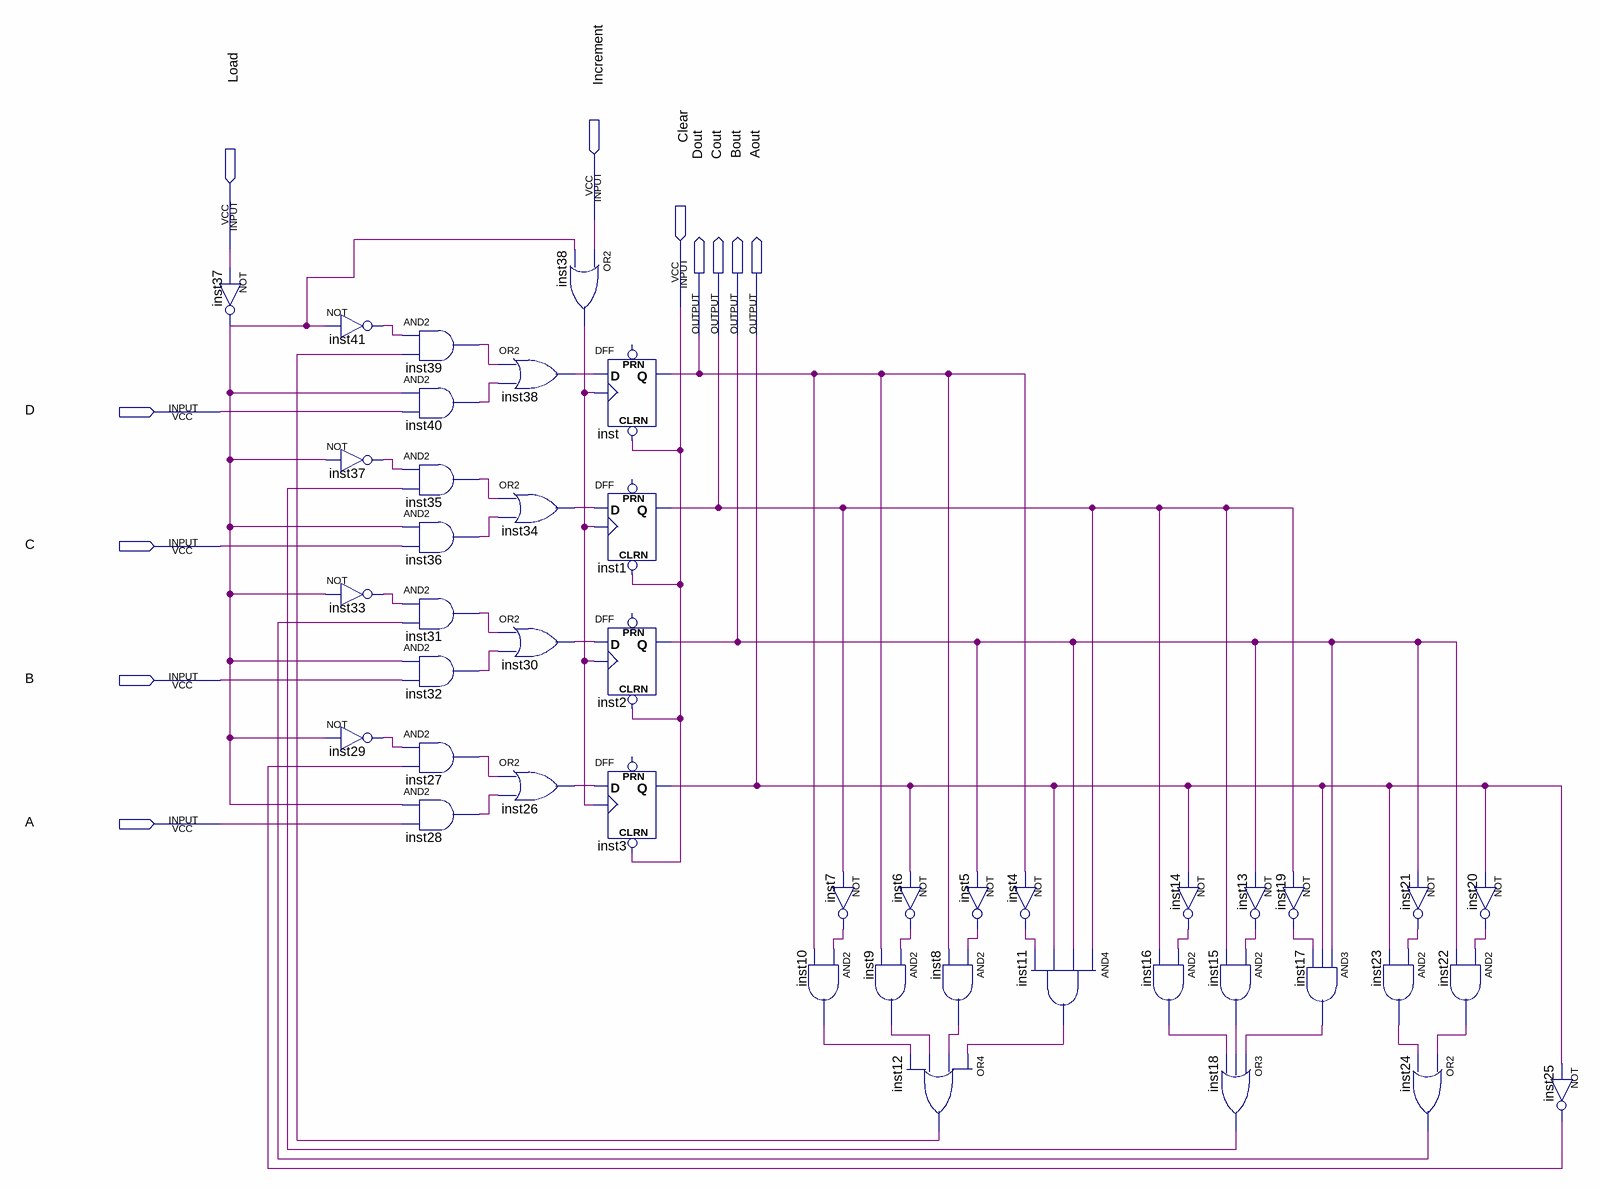
[diagram p0: schematic sheet]
// Quartus schematic Lab6_4.bdf as structural Verilog: 44 symbols, 11 pins
module Lab6_4 (
  input  Increment,
  input  Load,
  input  Clear,
  input  D,
  input  C,
  input  B,
  input  A,
  output Dout,
  output Cout,
  output Bout,
  output Aout
);

  wire inst4_out, inst5_out, inst6_out, inst7_out, inst8_out, inst9_out, inst10_out, inst11_out, inst12_out,
       inst13_out, inst14_out, inst15_out, inst16_out, inst17_out, inst18_out, inst19_out, inst20_out,
       inst21_out, inst22_out, inst23_out, inst24_out, inst25_out, inst26_out, inst27_out, inst28_out,
       inst29_out, inst30_out, inst31_out, inst32_out, inst33_out, inst34_out, inst35_out, inst36_out,
       inst37_out, inst37_out_2, inst38_out, inst38_out_2, inst39_out, inst40_out, inst41_out;

  not inst37 (inst37_out_2, Load);
  not inst41 (inst41_out, inst37_out_2);
  not inst37_dup2 (inst37_out, inst37_out_2);
  not inst33 (inst33_out, inst37_out_2);
  not inst29 (inst29_out, inst37_out_2);
  and inst39 (inst39_out, inst41_out, inst12_out);
  and inst40 (inst40_out, inst37_out_2, D);
  and inst35 (inst35_out, inst37_out, inst18_out);
  and inst36 (inst36_out, inst37_out_2, C);
  and inst31 (inst31_out, inst33_out, inst24_out);
  and inst32 (inst32_out, inst37_out_2, B);
  and inst27 (inst27_out, inst29_out, inst25_out);
  and inst28 (inst28_out, inst37_out_2, A);
  or inst38 (inst38_out, inst39_out, inst40_out);
  or inst34 (inst34_out, inst35_out, inst36_out);
  or inst30 (inst30_out, inst31_out, inst32_out);
  or inst26 (inst26_out, inst27_out, inst28_out);
  or inst38_dup2 (inst38_out_2, Increment, inst37_out_2);
  DFF inst (.CLRN(Clear), .CLK(inst38_out_2), .D(inst38_out), .Q(Dout));  // open: PRN
  DFF inst1 (.CLRN(Clear), .CLK(inst38_out_2), .D(inst34_out), .Q(Cout));  // open: PRN
  DFF inst2 (.CLRN(Clear), .CLK(inst38_out_2), .D(inst30_out), .Q(Bout));  // open: PRN
  DFF inst3 (.CLRN(Clear), .CLK(inst38_out_2), .D(inst26_out), .Q(Aout));  // open: PRN
  not inst7 (inst7_out, Cout);
  and inst10 (inst10_out, inst7_out, Dout);
  not inst6 (inst6_out, Aout);
  and inst9 (inst9_out, inst6_out, Dout);
  or inst12 (inst12_out, inst11_out, inst8_out, inst9_out, inst10_out);
  not inst5 (inst5_out, Bout);
  and inst8 (inst8_out, inst5_out, Dout);
  not inst4 (inst4_out, Dout);
  and inst11 (inst11_out, Cout, Bout, Aout, inst4_out);
  and inst16 (inst16_out, inst14_out, Cout);
  not inst14 (inst14_out, Aout);
  and inst15 (inst15_out, inst13_out, Cout);
  or inst18 (inst18_out, inst17_out, inst15_out, inst16_out);
  not inst13 (inst13_out, Bout);
  not inst19 (inst19_out, Cout);
  and inst17 (inst17_out, Bout, Aout, inst19_out);
  and inst23 (inst23_out, inst21_out, Aout);
  not inst21 (inst21_out, Bout);
  and inst22 (inst22_out, inst20_out, Bout);
  or inst24 (inst24_out, inst22_out, inst23_out);
  not inst20 (inst20_out, Aout);
  not inst25 (inst25_out, Aout);
endmodule
